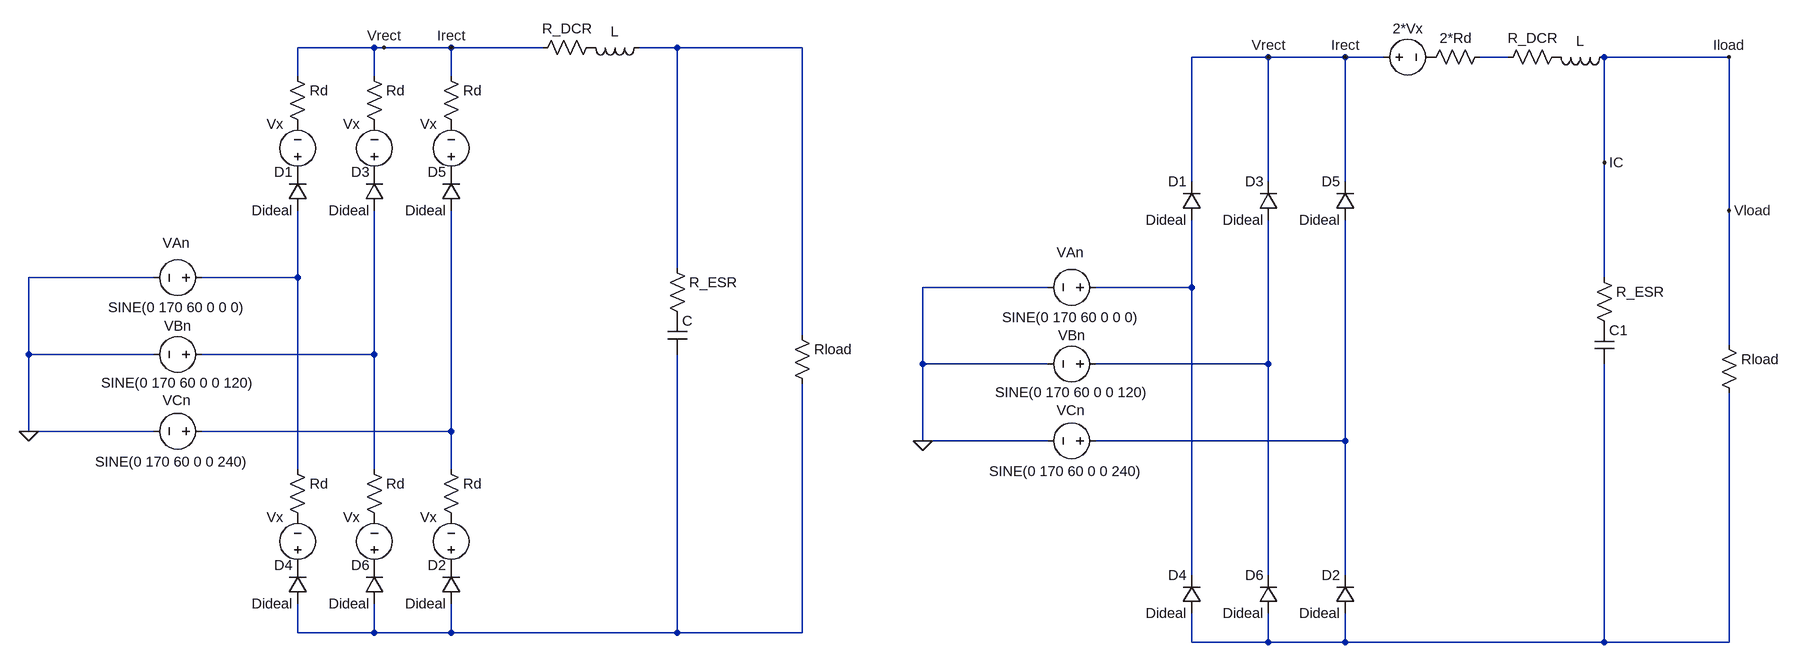
[diagram p0: schematic 3 Phase Rectifier.asc]
3 Phase Rectifier.asc, the LTspice schematic file:
Version 4
SHEET 1 3352 1272
WIRE 640 272 512 272
WIRE 656 272 640 272
WIRE 768 272 656 272
WIRE 976 272 768 272
WIRE 1200 272 1136 272
WIRE 1408 272 1200 272
WIRE 2480 288 2352 288
WIRE 2608 288 2480 288
WIRE 2672 288 2608 288
WIRE 2880 288 2832 288
WIRE 3248 288 3040 288
WIRE 512 320 512 272
WIRE 640 320 640 272
WIRE 768 320 768 272
WIRE 3040 464 3040 288
WIRE 2352 496 2352 288
WIRE 2480 496 2480 288
WIRE 2608 496 2608 288
WIRE 3248 544 3248 288
WIRE 1200 640 1200 272
WIRE 272 656 64 656
WIRE 512 656 512 544
WIRE 512 656 352 656
WIRE 3040 656 3040 464
WIRE 2112 672 1904 672
WIRE 2352 672 2352 560
WIRE 2352 672 2192 672
WIRE 1408 752 1408 272
WIRE 3248 768 3248 544
WIRE 64 784 64 656
WIRE 272 784 64 784
WIRE 640 784 640 544
WIRE 640 784 352 784
WIRE 1904 800 1904 672
WIRE 2112 800 1904 800
WIRE 2480 800 2480 560
WIRE 2480 800 2192 800
WIRE 64 912 64 784
WIRE 272 912 64 912
WIRE 768 912 768 544
WIRE 768 912 352 912
WIRE 1904 928 1904 800
WIRE 2112 928 1904 928
WIRE 2608 928 2608 560
WIRE 2608 928 2192 928
WIRE 512 976 512 656
WIRE 640 976 640 784
WIRE 768 976 768 912
WIRE 2352 1152 2352 672
WIRE 2480 1152 2480 800
WIRE 2608 1152 2608 928
WIRE 512 1248 512 1200
WIRE 640 1248 640 1200
WIRE 640 1248 512 1248
WIRE 768 1248 768 1200
WIRE 768 1248 640 1248
WIRE 1200 1248 1200 784
WIRE 1200 1248 768 1248
WIRE 1408 1248 1408 832
WIRE 1408 1248 1200 1248
WIRE 2352 1264 2352 1216
WIRE 2480 1264 2480 1216
WIRE 2480 1264 2352 1264
WIRE 2608 1264 2608 1216
WIRE 2608 1264 2480 1264
WIRE 3040 1264 3040 800
WIRE 3040 1264 2608 1264
WIRE 3248 1264 3248 848
WIRE 3248 1264 3040 1264
FLAG 64 912 0
FLAG 1904 928 0
FLAG 768 272 Irect
FLAG 2608 288 Irect
FLAG 3248 288 Iload
FLAG 3040 464 IC
FLAG 2480 288 Vrect
FLAG 656 272 Vrect
FLAG 3248 544 Vload
SYMBOL voltage 368 656 R90
WINDOW 123 0 0 Left 0
WINDOW 39 0 0 Left 0
WINDOW 0 -58 36 VRight 2
WINDOW 3 50 -56 VRight 2
SYMATTR InstName VAn
SYMATTR Value SINE(0 170 60 0 0 0)
SYMBOL voltage 368 912 R90
WINDOW 0 -51 34 VRight 2
WINDOW 3 51 -61 VRight 2
WINDOW 123 0 0 Left 0
WINDOW 39 0 0 Left 0
SYMATTR InstName VCn
SYMATTR Value SINE(0 170 60 0 0 240)
SYMBOL voltage 368 784 R90
WINDOW 0 -32 56 VBottom 2
WINDOW 3 32 56 VTop 2
SYMATTR InstName VBn
SYMATTR Value SINE(0 170 60 0 0 120)
SYMBOL diode 528 544 R180
WINDOW 0 24 64 Left 2
WINDOW 3 24 0 Left 2
SYMATTR InstName D1
SYMATTR Value Dideal
SYMBOL diode 656 544 R180
WINDOW 0 24 64 Left 2
WINDOW 3 24 0 Left 2
SYMATTR InstName D3
SYMATTR Value Dideal
SYMBOL diode 784 544 R180
WINDOW 0 24 64 Left 2
WINDOW 3 24 0 Left 2
SYMATTR InstName D5
SYMATTR Value Dideal
SYMBOL diode 528 1200 R180
WINDOW 0 24 64 Left 2
WINDOW 3 24 0 Left 2
SYMATTR InstName D4
SYMATTR Value Dideal
SYMBOL diode 656 1200 R180
WINDOW 0 24 64 Left 2
WINDOW 3 24 0 Left 2
SYMATTR InstName D6
SYMATTR Value Dideal
SYMBOL diode 784 1200 R180
WINDOW 0 24 64 Left 2
WINDOW 3 24 0 Left 2
SYMATTR InstName D2
SYMATTR Value Dideal
SYMBOL voltage 512 496 R180
WINDOW 0 24 96 Left 2
WINDOW 3 24 16 Left 2
SYMATTR InstName Vx
SYMATTR Value ""
SYMBOL voltage 640 496 R180
WINDOW 0 24 96 Left 2
WINDOW 3 24 16 Left 2
SYMATTR InstName Vx
SYMATTR Value ""
SYMBOL voltage 768 496 R180
WINDOW 0 24 96 Left 2
WINDOW 3 24 16 Left 2
SYMATTR InstName Vx
SYMATTR Value ""
SYMBOL res 496 304 R0
SYMATTR InstName Rd
SYMATTR Value ""
SYMBOL res 624 304 R0
SYMATTR InstName Rd
SYMATTR Value ""
SYMBOL res 752 304 R0
SYMATTR InstName Rd
SYMATTR Value ""
SYMBOL voltage 512 1152 R180
WINDOW 0 24 96 Left 2
WINDOW 3 24 16 Left 2
SYMATTR InstName Vx
SYMATTR Value ""
SYMBOL voltage 640 1152 R180
WINDOW 0 24 96 Left 2
WINDOW 3 24 16 Left 2
SYMATTR InstName Vx
SYMATTR Value ""
SYMBOL voltage 768 1152 R180
WINDOW 0 24 96 Left 2
WINDOW 3 24 16 Left 2
SYMATTR InstName Vx
SYMATTR Value ""
SYMBOL res 496 960 R0
SYMATTR InstName Rd
SYMATTR Value ""
SYMBOL res 624 960 R0
SYMATTR InstName Rd
SYMATTR Value ""
SYMBOL res 752 960 R0
SYMATTR InstName Rd
SYMATTR Value ""
SYMBOL res 1392 736 R0
SYMATTR InstName Rload
SYMATTR Value ""
SYMBOL res 1184 624 R0
SYMATTR InstName R_ESR
SYMATTR Value ""
SYMBOL res 1072 256 R90
WINDOW 0 0 56 VBottom 2
WINDOW 3 32 56 VTop 2
SYMATTR InstName R_DCR
SYMATTR Value ""
SYMBOL ind 1152 256 R90
WINDOW 0 5 56 VBottom 2
WINDOW 3 32 56 VTop 2
SYMATTR InstName L
SYMATTR Value ""
SYMBOL cap 1184 720 R0
SYMATTR InstName C
SYMATTR Value ""
SYMBOL voltage 2208 672 R90
WINDOW 123 0 0 Left 0
WINDOW 39 0 0 Left 0
WINDOW 0 -58 36 VRight 2
WINDOW 3 50 -56 VRight 2
SYMATTR InstName VAn
SYMATTR Value SINE(0 170 60 0 0 0)
SYMBOL voltage 2208 928 R90
WINDOW 0 -51 34 VRight 2
WINDOW 3 51 -61 VRight 2
WINDOW 123 0 0 Left 0
WINDOW 39 0 0 Left 0
SYMATTR InstName VCn
SYMATTR Value SINE(0 170 60 0 0 240)
SYMBOL voltage 2208 800 R90
WINDOW 0 -32 56 VBottom 2
WINDOW 3 32 56 VTop 2
SYMATTR InstName VBn
SYMATTR Value SINE(0 170 60 0 0 120)
SYMBOL diode 2368 560 R180
WINDOW 0 24 64 Left 2
WINDOW 3 24 0 Left 2
SYMATTR InstName D1
SYMATTR Value Dideal
SYMBOL diode 2496 560 R180
WINDOW 0 24 64 Left 2
WINDOW 3 24 0 Left 2
SYMATTR InstName D3
SYMATTR Value Dideal
SYMBOL diode 2624 560 R180
WINDOW 0 24 64 Left 2
WINDOW 3 24 0 Left 2
SYMATTR InstName D5
SYMATTR Value Dideal
SYMBOL diode 2368 1216 R180
WINDOW 0 24 64 Left 2
WINDOW 3 24 0 Left 2
SYMATTR InstName D4
SYMATTR Value Dideal
SYMBOL diode 2496 1216 R180
WINDOW 0 24 64 Left 2
WINDOW 3 24 0 Left 2
SYMATTR InstName D6
SYMATTR Value Dideal
SYMBOL diode 2624 1216 R180
WINDOW 0 24 64 Left 2
WINDOW 3 24 0 Left 2
SYMATTR InstName D2
SYMATTR Value Dideal
SYMBOL res 3232 752 R0
SYMATTR InstName Rload
SYMATTR Value ""
SYMBOL res 3024 640 R0
SYMATTR InstName R_ESR
SYMATTR Value ""
SYMBOL res 2976 272 R90
WINDOW 0 0 56 VBottom 2
WINDOW 3 32 56 VTop 2
SYMATTR InstName R_DCR
SYMATTR Value ""
SYMBOL ind 3056 272 R90
WINDOW 0 5 56 VBottom 2
WINDOW 3 32 56 VTop 2
SYMATTR InstName L
SYMATTR Value ""
SYMBOL cap 3024 736 R0
SYMATTR InstName C1
SYMATTR Value ""
SYMBOL voltage 2656 288 R270
WINDOW 0 32 56 VTop 2
WINDOW 3 -32 56 VBottom 2
SYMATTR InstName 2*Vx
SYMATTR Value ""
SYMBOL res 2848 272 R90
WINDOW 0 0 56 VBottom 2
WINDOW 3 32 56 VTop 2
SYMATTR InstName 2*Rd
SYMATTR Value ""

The netlist it stands for:
* 3 Phase Rectifier.asc
VAn N003 0 SINE(0 170 60 0 0 0)
VCn N007 0 SINE(0 170 60 0 0 240)
VBn N005 0 SINE(0 170 60 0 0 120)
D1 N003 P001 Dideal
D3 N005 P002 Dideal
D5 N007 P003 Dideal
D4 N009 P004 Dideal
D6 N009 P005 Dideal
D2 N009 P006 Dideal
Vx P001 P007
Vx P002 P008
Vx P003 P009
Rd Vrect P007
Rd Vrect P008
Rd Vrect P009
Vx P004 P010
Vx P005 P011
Vx P006 P012
Rd N003 P010
Rd N005 P011
Rd N007 P012
Rload N001 N009
R_ESR N001 P013
R_DCR P014 Vrect
L N001 P014
C P013 N009
VAn N004 0 SINE(0 170 60 0 0 0)
VCn N008 0 SINE(0 170 60 0 0 240)
VBn N006 0 SINE(0 170 60 0 0 120)
D1 N004 Vrect Dideal
D3 N006 Vrect Dideal
D5 N008 Vrect Dideal
D4 N010 N004 Dideal
D6 N010 N006 Dideal
D2 N010 N008 Dideal
Rload Vload N010
R_ESR Vload P015
R_DCR P016 N002
L Vload P016
C1 P015 N010
V§2*Vx Vrect P017
R§2*Rd N002 P017
.model D D
.lib standard.dio
.backanno
.end